# EAGLE schematic final_design_v1 (EAGLE 9.4.0)

## Sheet 1 of 2: STM32F103C8 - Microcontroller
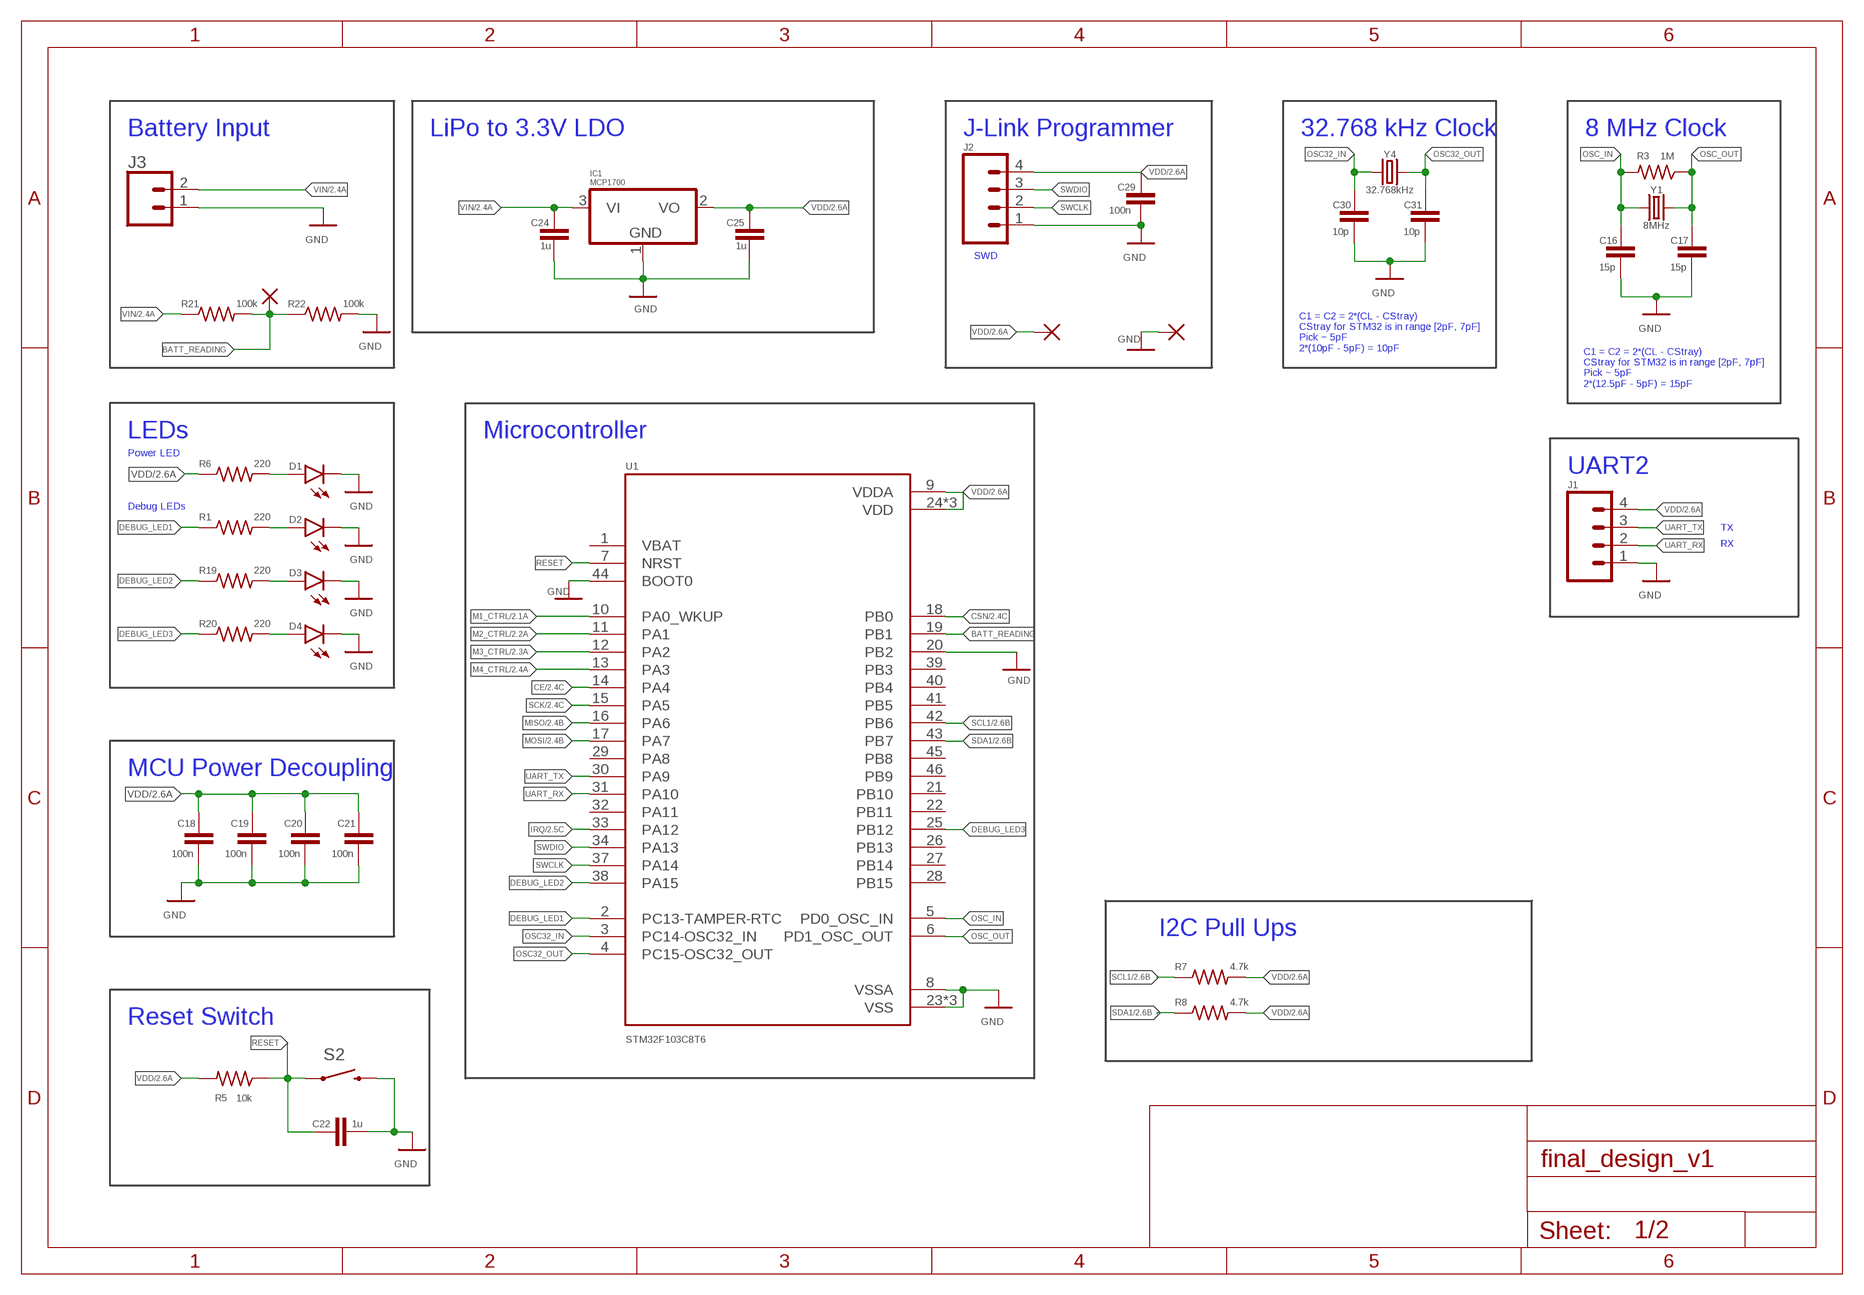
[diagram p0: schematic, sheet 1]

### Parts
+M18  SMD2  [SMD1,27-2,54]
+M19  SMD2  [SMD1,27-2,54]
+M20  SMD2  [SMD1,27-2,54]
C16  15p  C0603C100C5GACTU  [CAP_0603]
C17  15p  C0603C100C5GACTU  [CAP_0603]
C18  100n  C0603C100C5GACTU  [CAP_0603]
C19  100n  C0603C100C5GACTU  [CAP_0603]
C20  100n  C0603C100C5GACTU  [CAP_0603]
C21  100n  C0603C100C5GACTU  [CAP_0603]
C22  1u  C0603C100C5GACTU  [CAP_0603]
C24  1u  C0603C100C5GACTU  [CAP_0603]
C25  1u  C0603C100C5GACTU  [CAP_0603]
C29  100n  C0603C100C5GACTU  [CAP_0603]
C30  10p  C0603C100C5GACTU  [CAP_0603]
C31  10p  C0603C100C5GACTU  [CAP_0603]
D1  LED0603  [LED-0603]
D2  LED0603  [LED-0603]
D3  LED0603  [LED-0603]
D4  LED0603  [LED-0603]
IC1  MCP1700  MCP1703CB  [SOT23]
J1  CONN_04  [1X04]
J2  CONN_04  [1X04]
J3  CONN_02  [1X02]
R1  220  RC0603JR-070RL  [RES_0603]
R3  1M  RC0603JR-070RL  [RES_0603]
R5  10k  RC0603JR-070RL  [RES_0603]
R6  220  RC0603JR-070RL  [RES_0603]
R7  4.7k  RC0603JR-070RL  [RES_0603]
R8  4.7k  RC0603JR-070RL  [RES_0603]
R19  220  RC0603JR-070RL  [RES_0603]
R20  220  RC0603JR-070RL  [RES_0603]
R21  100k  RC0603JR-070RL  [RES_0603]
R22  100k  RC0603JR-070RL  [RES_0603]
S2  RS032G05A3SM-SPST-MOMENTARY-SWSMD-1101NE  [TACTILE-SWITCH-1101NE]
U1  STM32F103C8T6  [QFP50P900X900X160-48N]
Y1  8MHz  CRYSTAL-8MHZSMD-5X3.2  [CRYSTAL-SMD-5X3.2-4PAD]
Y4  32.768kHz  CRYSTAL-32.768KHZSMD-3.2X1.5  [CRYSTAL-SMD-3.2X1.5MM]

### Nets
BATT_READING: +M20.1(P) R21.2 R22.1 U1.19(PB1)
CE: U1.14(PA4) ; also sheet 2
CSN: U1.18(PB0) ; also sheet 2
DEBUG_LED1: R1.1 U1.2(PC13-TAMPER-RTC)
DEBUG_LED2: R19.1 U1.38(PA15)
DEBUG_LED3: R20.1 U1.25(PB12)
GND: +M19.1(P) C16.2 C17.2 C18.2 C19.2 C20.2 C21.2 C22.2 C24.2 C25.2 C29.2 C30.2 C31.2 D1.C D2.C D3.C D4.C IC1.1(GND) J1.1 J2.1 J3.1 R22.2 S2.2 U1.8(VSSA) U1.20(PB2) U1.23(VSS) U1.35(VSS) U1.44(BOOT0) U1.47(VSS) ; also sheet 2
IRQ: U1.33(PA12) ; also sheet 2
M1_CTRL: U1.10(PA0_WKUP) ; also sheet 2
M2_CTRL: U1.11(PA1) ; also sheet 2
M3_CTRL: U1.12(PA2) ; also sheet 2
M4_CTRL: U1.13(PA3) ; also sheet 2
MISO: U1.16(PA6) ; also sheet 2
MOSI: U1.17(PA7) ; also sheet 2
N$4: D1.A R6.2
N$6: D2.A R1.2
N$20: D3.A R19.2
N$21: D4.A R20.2
OSC32_IN: C30.1 U1.3(PC14-OSC32_IN) Y4.P$1
OSC32_OUT: C31.1 U1.4(PC15-OSC32_OUT) Y4.P$2
OSC_IN: C16.1 R3.2 U1.5(PD0_OSC_IN) Y1.1
OSC_OUT: C17.1 R3.1 U1.6(PD1_OSC_OUT) Y1.3
RESET: C22.1 R5.1 S2.1 U1.7(NRST)
SCK: U1.15(PA5) ; also sheet 2
SCL1: R7.1 U1.42(PB6) ; also sheet 2
SDA1: R8.1 U1.43(PB7) ; also sheet 2
SWCLK: J2.2 U1.37(PA14)
SWDIO: J2.3 U1.34(PA13)
UART_RX: J1.2 U1.31(PA10)
UART_TX: J1.3 U1.30(PA9)
VDD: +M18.1(P) C18.1 C19.1 C20.1 C21.1 C25.1 C29.1 IC1.2(VO) J1.4 J2.4 R5.2 R6.1 R7.2 R8.2 U1.9(VDDA) U1.24(VDD) U1.36(VDD) U1.48(VDD) ; also sheet 2
VIN: C24.1 IC1.3(VI) J3.2 R21.1 ; also sheet 2
Unconnected: U1.1(VBAT) U1.21(PB10) U1.22(PB11) U1.26(PB13) U1.27(PB14) U1.28(PB15) U1.29(PA8) U1.32(PA11) U1.39(PB3) U1.40(PB4) U1.41(PB5) U1.45(PB8) U1.46(PB9)

### Notes on the sheet
- Battery Input | LiPo to 3.3V LDO | J-Link Programmer | 32.768 kHz Clock | 8 MHz Clock
- SWD
- C1 = C2 = 2*(CL - CStray)
  CStray for STM32 is in range [2pF, 7pF]
  Pick ~ 5pF
  2*(10pF - 5pF) = 10pF
- C1 = C2 = 2*(CL - CStray)
  CStray for STM32 is in range [2pF, 7pF]
  Pick ~ 5pF
  2*(12.5pF - 5pF) = 15pF
- LEDs | Microcontroller
- Power LED
- UART2
- Debug LEDs
- TX
- RX
- MCU Power Decoupling
- I2C Pull Ups
- Reset Switch

## Sheet 2 of 2: Sensors, Actuators, Comms
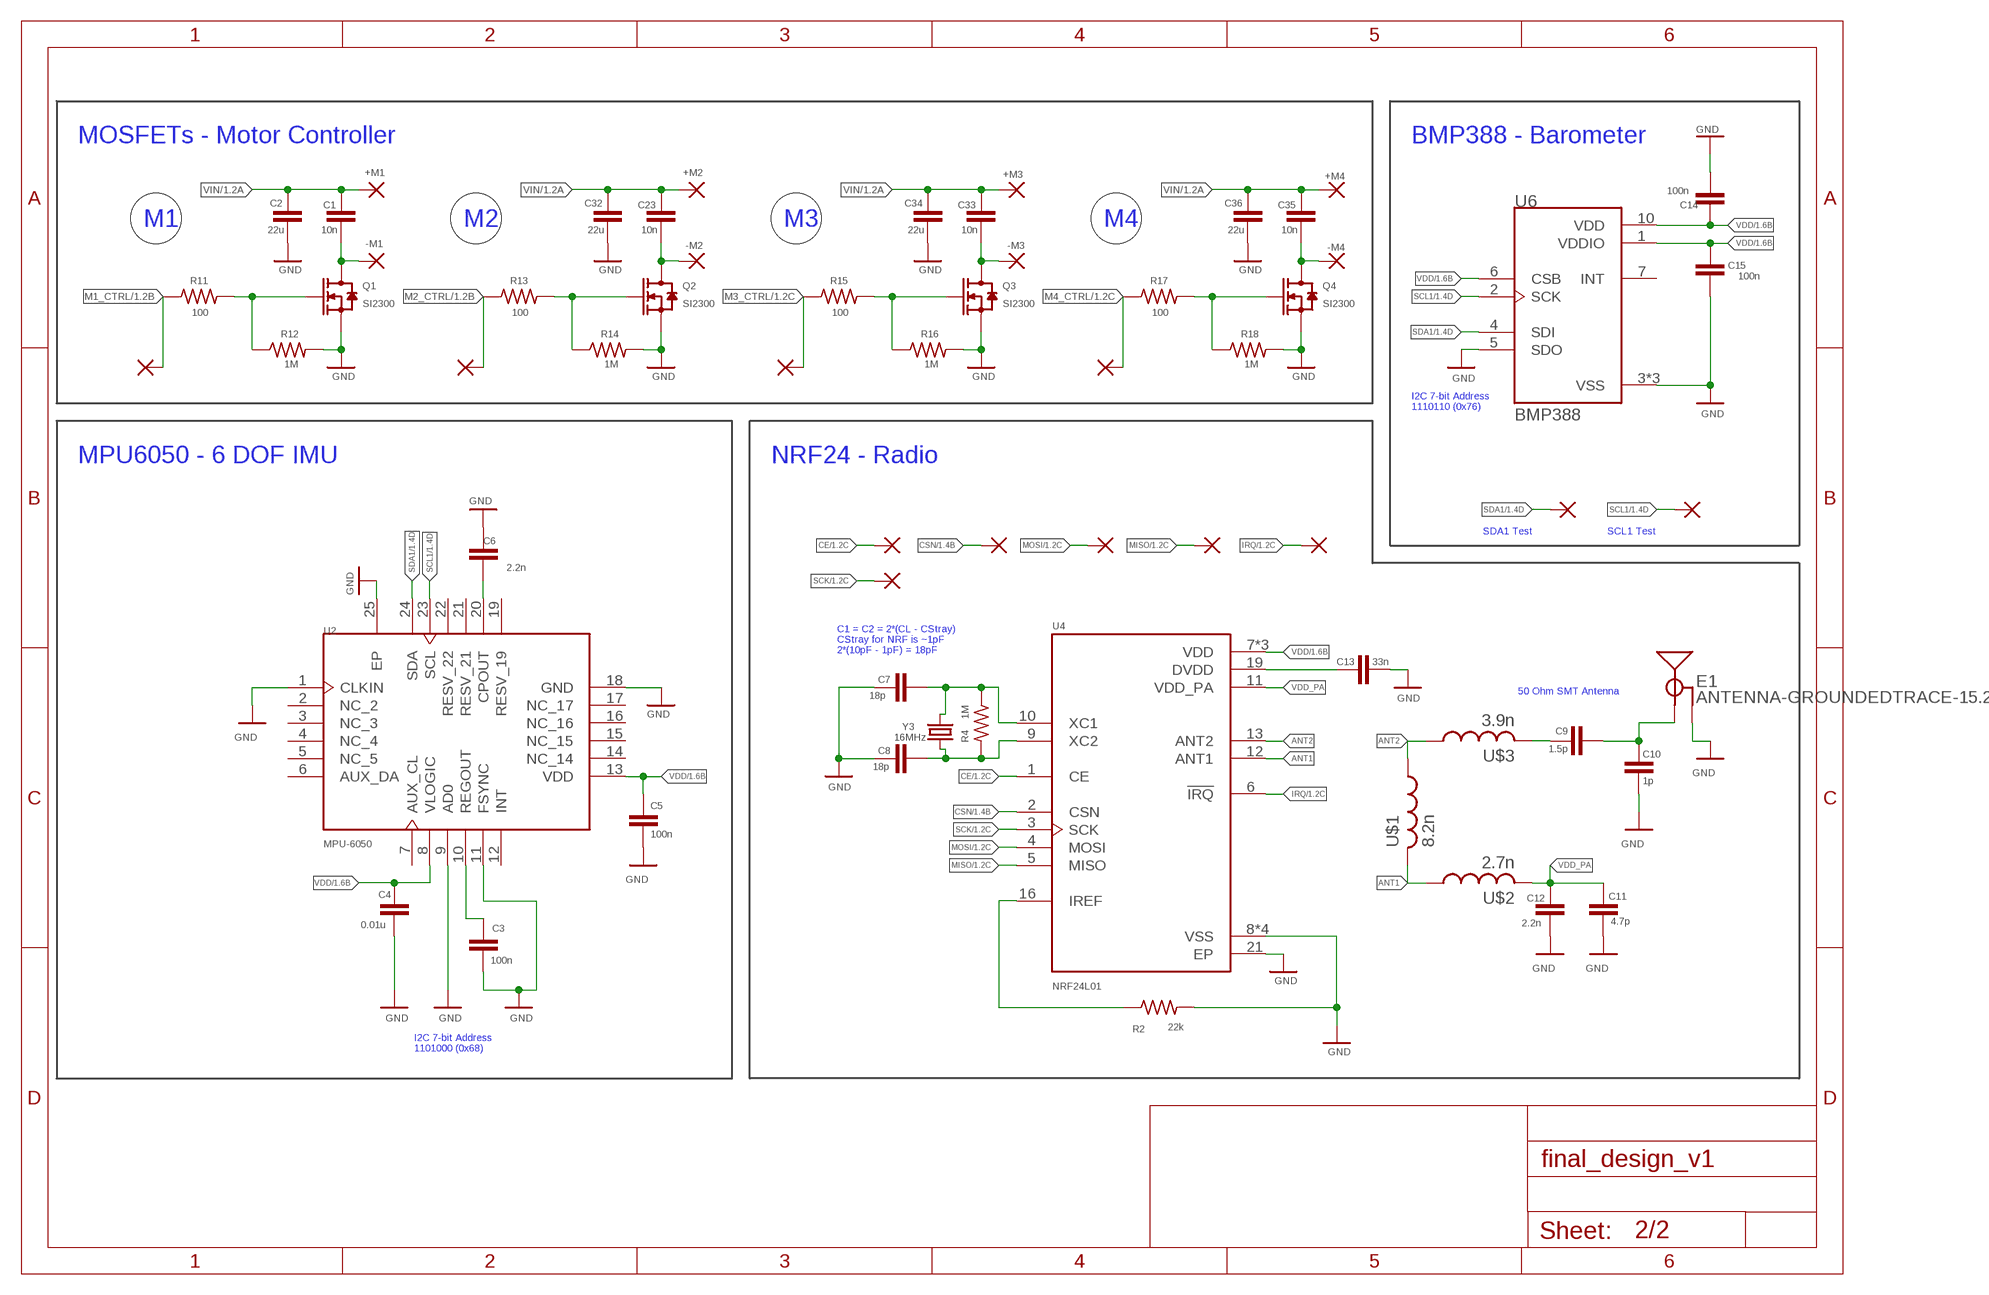
[diagram p1: schematic, sheet 2]

### Parts
+M1  SMD2  [SMD1,27-2,54]
+M2  SMD2  [SMD1,27-2,54]
+M3  SMD2  [SMD1,27-2,54]
+M4  SMD2  [SMD1,27-2,54]
+M5  SMD2  [SMD1,27-2,54]
+M6  SMD2  [SMD1,27-2,54]
+M7  SMD2  [SMD1,27-2,54]
+M8  SMD2  [SMD1,27-2,54]
+M9  SMD2  [SMD1,27-2,54]
+M10  SMD2  [SMD1,27-2,54]
+M13  SMD2  [SMD1,27-2,54]
+M14  SMD2  [SMD1,27-2,54]
+M15  SMD2  [SMD1,27-2,54]
+M16  SMD2  [SMD1,27-2,54]
+M17  SMD2  [SMD1,27-2,54]
+M22  SMD2  [SMD1,27-2,54]
-M1  SMD2  [SMD1,27-2,54]
-M2  SMD2  [SMD1,27-2,54]
-M3  SMD2  [SMD1,27-2,54]
-M4  SMD2  [SMD1,27-2,54]
C1  10n  C0603C100C5GACTU  [CAP_0603]
C2  22u  C0603C100C5GACTU  [CAP_0603]
C3  100n  C0603C100C5GACTU  [CAP_0603]
C4  0.01u  C0603C100C5GACTU  [CAP_0603]
C5  100n  C0603C100C5GACTU  [CAP_0603]
C6  2.2n  C0603C100C5GACTU  [CAP_0603]
C7  18p  C0603C100C5GACTU  [CAP_0603]
C8  18p  C0603C100C5GACTU  [CAP_0603]
C9  1.5p  C0603C100C5GACTU  [CAP_0603]
C10  1p  C0603C100C5GACTU  [CAP_0603]
C11  4.7p  C0603C100C5GACTU  [CAP_0603]
C12  2.2n  C0603C100C5GACTU  [CAP_0603]
C13  33n  C0603C100C5GACTU  [CAP_0603]
C14  100n  C0603C100C5GACTU  [CAP_0603]
C15  100n  C0603C100C5GACTU  [CAP_0603]
C23  10n  C0603C100C5GACTU  [CAP_0603]
C32  22u  C0603C100C5GACTU  [CAP_0603]
C33  10n  C0603C100C5GACTU  [CAP_0603]
C34  22u  C0603C100C5GACTU  [CAP_0603]
C35  10n  C0603C100C5GACTU  [CAP_0603]
C36  22u  C0603C100C5GACTU  [CAP_0603]
E1  ANTENNA-GROUNDEDTRACE-15.2MM  [TRACE_ANTENNA_2.4GHZ_15.2MM]
Q1  SI2300  SMD-MOSFET-N-CH-60V-300MA-LOGIC-LEVEL-FET-2N7002(SOT-23)  [SOT-23]
Q2  SI2300  SMD-MOSFET-N-CH-60V-300MA-LOGIC-LEVEL-FET-2N7002(SOT-23)  [SOT-23]
Q3  SI2300  SMD-MOSFET-N-CH-60V-300MA-LOGIC-LEVEL-FET-2N7002(SOT-23)  [SOT-23]
Q4  SI2300  SMD-MOSFET-N-CH-60V-300MA-LOGIC-LEVEL-FET-2N7002(SOT-23)  [SOT-23]
R2  22k  RC0603JR-070RL  [RES_0603]
R4  1M  RC0603JR-070RL  [RES_0603]
R11  100  RC0603JR-070RL  [RES_0603]
R12  1M  RC0603JR-070RL  [RES_0603]
R13  100  RC0603JR-070RL  [RES_0603]
R14  1M  RC0603JR-070RL  [RES_0603]
R15  100  RC0603JR-070RL  [RES_0603]
R16  1M  RC0603JR-070RL  [RES_0603]
R17  100  RC0603JR-070RL  [RES_0603]
R18  1M  RC0603JR-070RL  [RES_0603]
U2  MPU-6050  [24-VFQFN]
U4  NRF24L01  [QFN50P400X400X95-21N]
U6  BMP388  [PQFN50P200X200X80-10N]
U$1  8.2n  INDUCTOR_0603_N  [RESC0603_N]
U$2  2.7n  INDUCTOR_0603_N  [RESC0603_N]
U$3  3.9n  INDUCTOR_0603_N  [RESC0603_N]
Y3  16MHz  CRYSTAL-16MHZSMD-5X3.2  [CRYSTAL-SMD-5X3.2-4PAD]

### Nets
ANT1: U4.12(ANT1) U$1.2 U$2.1
ANT2: U4.13(ANT2) U$1.1 U$3.1
CE: +M13.1(P) U4.1(CE) ; also sheet 1
CSN: +M14.1(P) U4.2(CSN) ; also sheet 1
GND: C2.1 C3.2 C4.2 C5.2 C6.2 C7.2 C8.2 C10.1 C11.1 C12.1 C13.2 C14.2 C15.1 C32.1 C34.1 C36.1 E1.GND Q1.2(S) Q2.2(S) Q3.2(S) Q4.2(S) R2.2 R12.2 R14.2 R16.2 R18.2 U2.1(CLKIN) U2.9(AD0) U2.11(FSYNC) U2.18(GND) U2.25(EP) U4.8(VSS) U4.14(VSS) U4.17(VSS) U4.20(VSS) U4.21(EP) U6.3(VSS) U6.5(SDO) U6.8(VSS) U6.9(VSS) ; also sheet 1
IRQ: +M17.1(P) U4.6(!IRQ) ; also sheet 1
M1_CTRL: +M10.1(P) R11.1 ; also sheet 1
M2_CTRL: +M9.1(P) R13.1 ; also sheet 1
M3_CTRL: +M8.1(P) R15.1 ; also sheet 1
M4_CTRL: +M7.1(P) R17.1 ; also sheet 1
MISO: +M16.1(P) U4.5(MISO) ; also sheet 1
MOSI: +M15.1(P) U4.4(MOSI) ; also sheet 1
N$1: -M1.1(P) C1.1 Q1.3(D)
N$2: C3.1 U2.10(REGOUT)
N$3: C6.1 U2.20(CPOUT)
N$7: C8.1 R4.2 U4.9(XC2) Y3.1
N$8: C7.1 R4.1 U4.10(XC1) Y3.3
N$9: R2.1 U4.16(IREF)
N$10: -M2.1(P) C23.1 Q2.3(D)
N$11: Q1.1(G) R11.2 R12.1
N$12: C9.2 C10.2 E1.ANT(SIGNAL)
N$13: C9.1 U$3.2
N$14: Q2.1(G) R13.2 R14.1
N$15: -M3.1(P) C33.1 Q3.3(D)
N$16: Q3.1(G) R15.2 R16.1
N$17: C13.1 U4.19(DVDD)
N$18: -M4.1(P) C35.1 Q4.3(D)
N$19: Q4.1(G) R17.2 R18.1
SCK: +M22.1(P) U4.3(SCK) ; also sheet 1
SCL1: +M6.1(P) U2.23(SCL) U6.2(SCK) ; also sheet 1
SDA1: +M5.1(P) U2.24(SDA) U6.4(SDI) ; also sheet 1
VDD: C4.1 C5.1 C14.1 C15.2 U2.8(VLOGIC) U2.13(VDD) U4.7(VDD) U4.15(VDD) U4.18(VDD) U6.1(VDDIO) U6.6(CSB) U6.10(VDD) ; also sheet 1
VDD_PA: C11.2 C12.2 U4.11(VDD_PA) U$2.2
VIN: +M1.1(P) +M2.1(P) +M3.1(P) +M4.1(P) C1.2 C2.2 C23.2 C32.2 C33.2 C34.2 C35.2 C36.2 ; also sheet 1
Unconnected: U2.2(NC_2) U2.3(NC_3) U2.4(NC_4) U2.5(NC_5) U2.6(AUX_DA) U2.7(AUX_CL) U2.12(INT) U2.14(NC_14) U2.15(NC_15) U2.16(NC_16) U2.17(NC_17) U2.19(RESV_19) U2.21(RESV_21) U2.22(RESV_22) U6.7(INT)

### Notes on the sheet
- MOSFETs - Motor Controller | BMP388 - Barometer
- M1 | M2 | M3 | M4
- I2C 7-bit Address
  1110110 (0x76)
- MPU6050 - 6 DOF IMU | NRF24 - Radio
- SDA1 Test | SCL1 Test
- C1 = C2 = 2*(CL - CStray)
  CStray for NRF is ~1pF
  2*(10pF - 1pF) = 18pF
- 50 Ohm SMT Antenna
- I2C 7-bit Address
  1101000 (0x68)

## Library data of the parts
+M1-+M10 +M13-+M20 +M22 -M1--M4 = wirepad:SMD2: SMD PAD
C1-C25 C29-C36 = Resistor_Capacitor:C0603C100C5GACTU: CAP CER 10PF 50V C0G/NP0 0603 Manufacturer's datasheet <https://content.kemet.com/datasheets/KEM_C1003_C0G_SMD.pdf>; CREATED_BY: PCBLayout.com; DIGIKEY_PART_NUMBER: 399-7814-2-ND; MANUFACTURER: KEMET; MPN: C0603C100C5GACTU; PACKAGE: SMD 0603
D1-D4 = SparkFun-LED:LED: LED (Generic) Standard schematic elements and footprints for 5mm, 3mm, 1206, and 0603 sized LEDs. Generic LEDs with no color specified.
E1 = SparkFun-RF:ANTENNA-GROUNDED: Antenna w/ Ground Connection 2.4GHz antennae with signal and ground terminals. TRACE_ANTENNA_2.4GHZ_15.2MM - Meander Trace antenna 15.2 x 5.7mm footprint Based on layout from TI app note AN043 <http://www.ti.com/lit/an/swra117d/swra117d.pdf>. TRACE_ANTENNA_2.4GHZ_25.7MM - Inverted F trace antenna 25.7 x 7.5 mm footprint. Based on layout from TI design note DN0007 <http://www.ti.com/lit/an/swru120b/swru120b.pdf>.
IC1 = linear:MCP1703: 250 mA, 16V, Low Quiescent Current LDO Regulator Source: http://ww1.microchip.com/downloads/en/DeviceDoc/22049b.pdf
J1 J2 = SparkFun-Connectors:CONN_04: Multi connection point. Often used as Generic Header-pin footprint for 0.1 inch spaced/style header connections On any of the 0.1 inch spaced packages, you can populate with these: Break Away Headers - Straight <https://www.sparkfun.com/products/116> (PRT-00116) Break Away Male Headers - Right Angle <https://www.sparkfun.com/products/553> (PRT-00553) Female Headers <https://www.sparkfun.com/products/115> (PRT-00115) Break Away Headers - Machine Pin <https://www.sparkfun.com/products/117> (PRT-00117) Break Away Female Headers - Swiss Machine Pin <https://www.sparkfun.com/products/743> (PRT-00743) For SCREWTERMINALS and SPRING TERMINALS visit here: Screw Terimnals on SparkFun.com <https://www.sparkfun.com/search/results?term=Screw+Terminals> (5mm/3.5mm/2.54mm spacing) This device is also useful as a general connection point to wire up your design to another part of your project. Our various solder wires solder well into these plated through hole pads. Hook-Up Wire - Assortment (Stranded, 22 AWG) <https://www.sparkfun.com/products/11375> (PRT-11375) Hook-Up Wire - Assortment (Solid Core, 22 AWG) <https://www.sparkfun.com/products/11367> (PRT-11367) View the entire wire category on our website here <https://www.sparkfun.com/categories/141> Special notes: Molex polarized connector foot print use with SKU : PRT-08231 with associated crimp pins and housings. 1MM SMD Version SKU: PRT-10208; PROD_ID: CONN-09696
J3 = SparkFun-Connectors:CONN_02: Multi connection point. Often used as Generic Header-pin footprint for 0.1 inch spaced/style header connections On any of the 0.1 inch spaced packages, you can populate with these: Break Away Headers - Straight <https://www.sparkfun.com/products/116> (PRT-00116) Break Away Male Headers - Right Angle <https://www.sparkfun.com/products/553> (PRT-00553) Female Headers <https://www.sparkfun.com/products/115> (PRT-00115) Break Away Headers - Machine Pin <https://www.sparkfun.com/products/117> (PRT-00117) Break Away Female Headers - Swiss Machine Pin <https://www.sparkfun.com/products/743> (PRT-00743) For SCREWTERMINALS and SPRING TERMINALS visit here: Screw Terimnals on SparkFun.com <https://www.sparkfun.com/search/results?term=Screw+Terminals> (5mm/3.5mm/2.54mm spacing) This device is also useful as a general connection point to wire up your design to another part of your project. Our various solder wires solder well into these plated through hole pads. Hook-Up Wire - Assortment (Stranded, 22 AWG) <https://www.sparkfun.com/products/11375> (PRT-11375) Hook-Up Wire - Assortment (Solid Core, 22 AWG) <https://www.sparkfun.com/products/11367> (PRT-11367) View the entire wire category on our website here <https://www.sparkfun.com/categories/141> Special notes: Molex polarized connector foot print use with: PRT-08233 with associated crimp pins and housings. 2.54_SCREWTERM for use with PRT-10571. 3.5mm Screw Terminal footprints for PRT-08084 5mm Screw Terminal footprints for use with PRT-08432
Q1-Q4 = OPL_Discrete_Semiconductor:SMD-MOSFET-N-CH-60V-300MA-LOGIC-LEVEL-FET-2N7002(SOT-23): 305030028; MPN: 2N7002,215; VALUE: 2N7002
R1-R8 R11-R22 = Resistor_Capacitor:RC0603JR-070RL: RES SMD 0 OHM JUMPER 1/10W 0603 Manufacturer's datasheet <http://www.yageo.com/documents/recent/PYu-RC_Group_51_RoHS_L_10.pdf>; CREATED_BY: PCBLayout.com; DIGIKEY_PART_NUMBER: 311-0.0GRTR-ND; MANUFACTURER: Yageo; MPN: RC0603JR-070RL; PACKAGE: SMD 0603
S2 = BeagleBone_Blue_R3:RS032G05A3SM-SPST-MOMENTARY-SW: 6x3.5mm 2-pin Momentary Switch (Push-button) Digikey Link <https://www.digikey.com/products/en?keywords=CKN10388TR-ND> Datasheet <https://media.digikey.com/pdf/Data%20Sheets/C&K/RS-032G05_-SM_RT.pdf>; PROD_ID: SWCH-00815
U1 = STM32F103C8T6:STM32F103C8T6: Mainstream Performance line, ARM Cortex-M3 MCU with 64 Kbytes Flash, 72 MHz CPU, motor control, USB and CAN Check prices <https://pricing.snapeda.com/parts/STM32F103C8T6/STMicroelectronics/view-part?ref=eda>; AVAILABILITY: Warning; DESCRIPTION: ARM® Cortex®-M3 STM32F1 Microcontroller IC 32-Bit 72MHz 64KB (64K x 8) FLASH 48-LQFP (7x7); MF: STMicroelectronics; MP: STM32F103C8T6; PACKAGE: LQFP-48 STMicroelectronics; PRICE: None; PURCHASE-URL: https://pricing.snapeda.com/search/part/STM32F103C8T6/?ref=eda; SPICEPREFIX: X
U2 = Sensor:MPU-6050: IMU ACCEL/GYRO 3-AXIS I2C 24QFN Manufacturer's datasheet <https://store.invensense.com/datasheets/invensense/MPU-6050_DataSheet_V3%204.pdf>; CREATED_BY: PCBLayout.com; DIGIKEY_PART_NUMBER: 1428-1007-1-ND; MANUFACTURER: TDK InvenSense; MPN: MPU-6050; PACKAGE: 24-VFQFN
U4 = NRF24L01:NRF24L01: The nRF24L01 is a single chip 2.4GHz transceiver with an embedded baseband protocol engine (Enhanced ShockBurst™), designed for ultra low power wireless applications. The nRF24L01 is designed for operation in the world wide ISM frequency band at 2.400 - 2.4835GHz. An MCU (microcontroller) and very few external passive components are needed to design a radio system with the nRF24L01. The nRF24L01 is configured and operated through a Serial Peripheral Interface (SPI.) Through this interface the register map is available. The register map contains all configuration registers in the nRF24L01 and is accessible in all operation modes of the chip. Check prices <https://pricing.snapeda.com/parts/NRF24L01/Nordic/view-part?ref=eda>; AVAILABILITY: Warning; DESCRIPTION: IC RF TxRx Only General ISM > 1GHZ 2.4GHz 20-VFQFN Exposed Pad; MF: Nordic; MP: NRF24L01; PACKAGE: VFQFN-20 Nordic Semiconductor; PRICE: None; PURCHASE-URL: https://pricing.snapeda.com/search/part/NRF24L01/?ref=eda
U6 = BMP388:BMP388: P-Sensor SPI I2C 1, 25 Bar SMD; DESCRIPTION: Pressure Sensor 4.35PSI ~ 18.13PSI (30kPa ~ 125kPa) Absolute 10-WFLGA; DIGI-KEY_PART_NUMBER: 828-1079-1-ND; MF: Bosch Sensortec; MP: BMP388; PACKAGE: WFLGA-10 Bosch Tools; PURCHASE-URL: https://pricing.snapeda.com/search/part/BMP388/?ref=eda
U$1-U$3 = Nordic_nRF:INDUCTOR: Generic chip inductor
Y1 = SparkFun-Clocks:CRYSTAL-8MHZ: 8MHz Crystal Datasheet Example <http://www.futureelectronics.com/en/technologies/electromechanical/timing-devices/crystals/Pages/6008189-ABM3B-8.000MHZ-B2-T.aspx?IM=0> Frequency: 8MHz Frequency Tolerance: ±20ppm Load Capacitance: 18pF SparkFun Products: Pro Micro -3.3V/8MHz <https://www.sparkfun.com/products/12587> WAV Trigger <https://www.sparkfun.com/products/13660>; PROD_ID: XTAL-09431
Y3 = SparkFun-Clocks:CRYSTAL-16MHZ: 16MHz Crystal Digikey Example <http://www.digikey.com/product-search/en?keywords=535-9122-1-ND> Frequency: 16MHz Frequency Stability: ±50ppm Frequency Tolerance: ±20ppm Load Capacitance: 18pF SparkFun Products: Pro Micro -5V/16MHz <https://www.sparkfun.com/products/12640> SparkFun Serial Enabled LCD Kit <https://www.sparkfun.com/products/10097>; PROD_ID: XTAL-08218; SF_ID: COM-00094
Y4 = SparkFun-Clocks:CRYSTAL-32.768KHZ: 32.768kHz Crystal Frequency: 32.768kHz Frequency Stability: ±20ppm Load Capacitance: 12.5pF (PTH-2X6 & SMD-3.2X1.5), 6pF (SMD-2X6) SparkFun Products: SparkFun BigTime Watch Kit <https://www.sparkfun.com/products/11734> SparkFun nRF52832 Breakout <https://www.sparkfun.com/products/13990> SparkFun Real Time Clock Module <https://www.sparkfun.com/products/12708>; PROD_ID: XTAL-13062